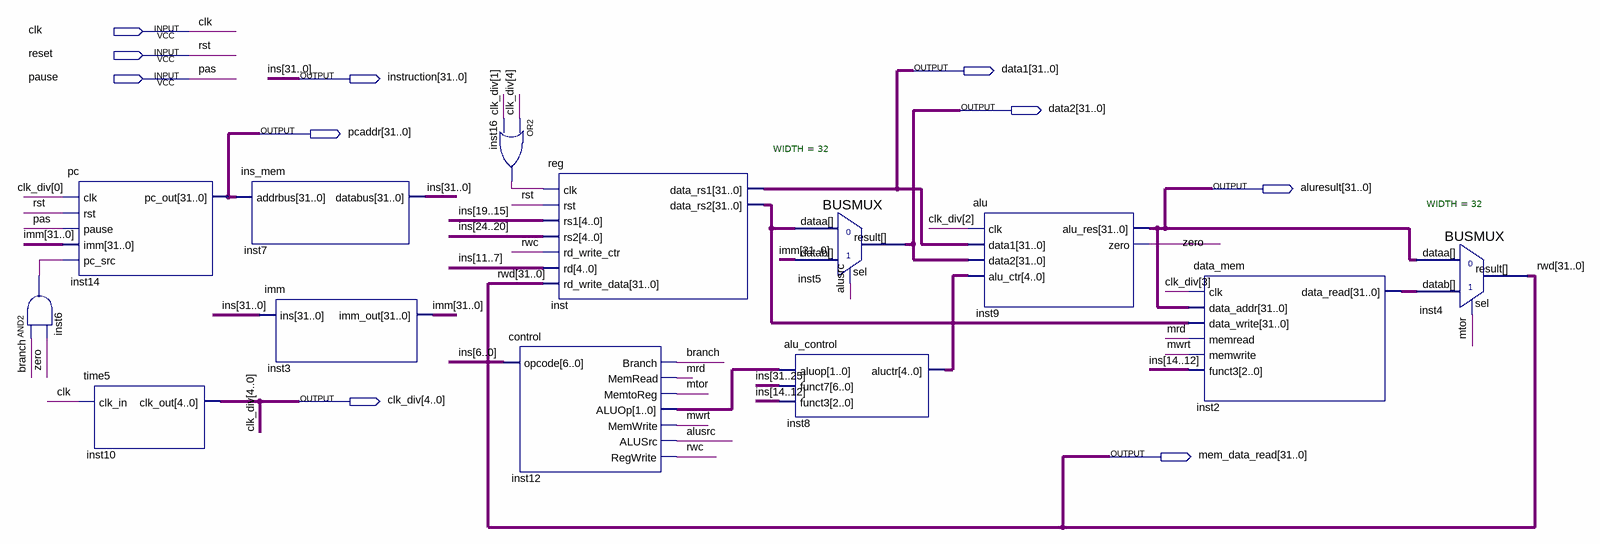
[diagram p0: schematic sheet]
// Quartus schematic riscv_1.bdf as structural Verilog: 13 symbols, 10 pins
module riscv_1 (
  input  clk,
  input  reset,
  input  pause,
  output [31:0] data1,
  output [31:0] instruction,
  output [31:0] data2,
  output [31:0] pcaddr,
  output [31:0] aluresult,
  output [4:0] clk_div,
  output [31:0] mem_data_read
);

  wire alusrc, branch, inst6_out, inst16_out, mrd, mtor, mwrt, rwc, zero;
  wire [1:0] inst12_aluop;
  wire [4:0] inst8_aluctr;
  wire [31:0] imm, inst2_data_read, inst_data_rs2;

  and inst6 (inst6_out, branch, zero);
  pc inst14 (.clk(clk_div[0]), .rst(reset), .pause(pause), .imm(imm), .pc_src(inst6_out), .pc_out(pcaddr));
  time5 inst10 (.clk_in(clk), .clk_out(clk_div));
  ins_mem inst7 (.addrbus(pcaddr), .databus(instruction));
  imm inst3 (.ins(instruction), .imm_out(imm));
  or inst16 (inst16_out, clk_div[4], clk_div[1]);
  control inst12 (
    .opcode(instruction[6:0]), .Branch(branch), .MemRead(mrd), .MemtoReg(mtor), .ALUOp(inst12_aluop),
    .MemWrite(mwrt), .ALUSrc(alusrc), .RegWrite(rwc));
  \reg  inst (
    .clk(inst16_out), .rst(reset), .rs1(instruction[19:15]), .rs2(instruction[24:20]), .rd_write_ctr(rwc),
    .rd(instruction[11:7]), .rd_write_data(mem_data_read), .data_rs1(data1), .data_rs2(inst_data_rs2));
  BUSMUX #(.WIDTH(32)) inst5 (.datab(imm), .sel(alusrc), .dataa(inst_data_rs2), .result(data2));
  alu_control inst8 (
    .aluop(inst12_aluop), .funct7(instruction[31:25]), .funct3(instruction[14:12]), .aluctr(inst8_aluctr));
  alu inst9 (.clk(clk_div[2]), .data1(data1), .data2(data2), .alu_ctr(inst8_aluctr), .alu_res(aluresult), .zero(zero));
  data_mem inst2 (
    .clk(clk_div[3]), .data_addr(aluresult), .data_write(inst_data_rs2), .memread(mrd), .memwrite(mwrt),
    .funct3(instruction[14:12]), .data_read(inst2_data_read));
  BUSMUX #(.WIDTH(32)) inst4 (.datab(inst2_data_read), .sel(mtor), .dataa(aluresult), .result(mem_data_read));

  // Other names for the same wires on the sheet: ins[31:0] = instruction; rwd[31:0] = mem_data_read; pas = pause;
  //   rst = reset
endmodule
